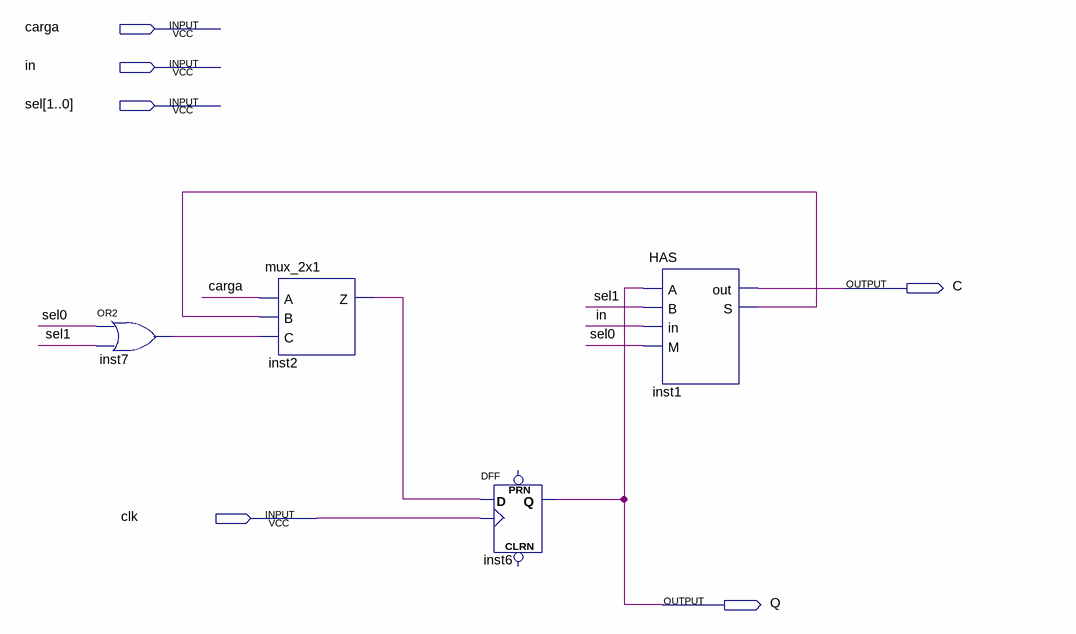
[diagram p0: schematic sheet]
// Quartus schematic cont_1bit.bdf as structural Verilog: 4 symbols, 6 pins
module cont_1bit (
  input  carga,
  input  in,
  input  [1:0] sel,
  input  clk,
  output C,
  output Q
);

  wire inst1_s, inst2_z, inst7_out;

  or inst7 (inst7_out, sel[0], sel[1]);
  mux_2x1 inst2 (.A(carga), .B(inst1_s), .C(inst7_out), .Z(inst2_z));
  DFF inst6 (.CLK(clk), .D(inst2_z), .Q(Q));  // open: CLRN, PRN
  HAS inst1 (.A(Q), .B(sel[1]), .in(in), .M(sel[0]), .out(C), .S(inst1_s));
endmodule
